# Altium schematic sheet Lab7-8_CH1.SchDoc
size B; DrawnBy: Aaron Huinink; SheetNumber: 2; SheetTotal: 5
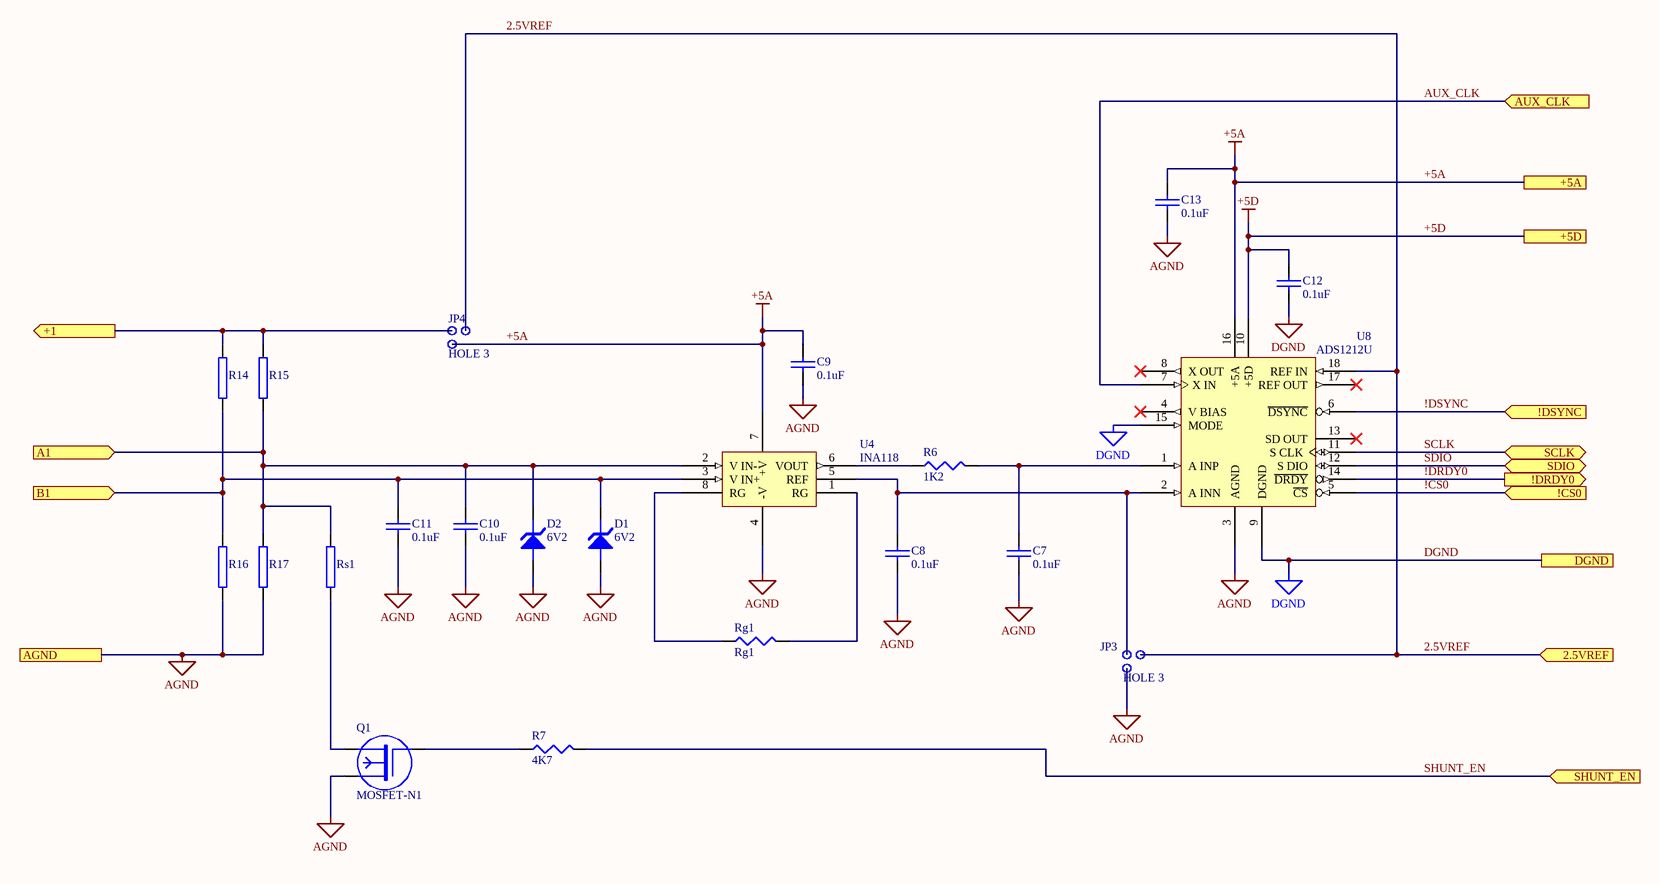
[diagram p0: Lab7-8_CH1.SchDoc]

## Parts
C7  0.1uF  [0805]
C8  0.1uF  [0805]
C9  0.1uF  [0805]
C10  0.1uF  [0805]
C11  0.1uF  [0805]
C12  0.1uF  [0805]
C13  0.1uF  [0805]
D1  6V2  [SOD-123]
D2  6V2  [SOD-123]
JP3  HOLE 3  [RAD0.1A]
JP4  HOLE 3  [RAD0.1A]
Q1  MOSFET-N1  [SOT-23]
R6  1K2  [0805]
R7  4K7  [0805]
R14  bridge R  [bridge resistor]  (value not drawn)
R15  bridge R  [bridge resistor]  (value not drawn)
R16  bridge R  [bridge resistor]  (value not drawn)
R17  bridge R  [bridge resistor]  (value not drawn)
Rg1  Rg1  [0805]
Rs1  bridge R  [bridge resistor]  (value not drawn)
U4  INA118  [SO-8]
U8  ADS1212U  [SOIC18]

## Ports
2.5VREF (in, see Lab7-8_TOP[4C], Lab7-8_CH2[6C], Lab7-8_CH3[6C], Lab7-8_CH4[6C]), !CS0 (in, see Lab7-8_TOP[4C]), !DRDY0 (out, see Lab7-8_TOP[4C]), !DSYNC (in, see Lab7-8_TOP[4C], Lab7-8_CH2[5B], Lab7-8_CH3[6B], Lab7-8_CH4[5B]), +1 (out, see Lab7-8_TOP[3C]), +5A (see Lab7-8_TOP[4C], Lab7-8_CH2[6B], Lab7-8_CH3[6B], Lab7-8_CH4[6B]), +5D (see Lab7-8_TOP[4C], Lab7-8_CH2[6B], Lab7-8_CH3[6B], Lab7-8_CH4[6B]), A1 (in, see Lab7-8_TOP[3C]), AGND (see Lab7-8_TOP[3C], Lab7-8_CH2[1C], Lab7-8_CH3[1C], Lab7-8_CH4[1C]), AUX_CLK (in, see Lab7-8_TOP[4C], Lab7-8_CH2[5A], Lab7-8_CH4[5A]), B1 (in, see Lab7-8_TOP[3C]), DGND (see Lab7-8_TOP[4C], Lab7-8_CH2[6C], Lab7-8_CH3[6C], Lab7-8_CH4[6C]), SCLK (bidir, see Lab7-8_TOP[4C], Lab7-8_CH2[5B], Lab7-8_CH3[6B], Lab7-8_CH4[5B]), SDIO (bidir, see Lab7-8_TOP[4C], Lab7-8_CH2[5B], Lab7-8_CH3[6B], Lab7-8_CH4[5B]), SHUNT_EN (in, see Lab7-8_TOP[4C], Lab7-8_CH2[6C], Lab7-8_CH3[6C], Lab7-8_CH4[6C])

## Nets
+5A: C9.1 C13.1 JP4.1 U4.7(+V) U8.16(+5A) ; port +5A  [also labelled +V]
+5D: C12.1 U8.10(+5D) ; port +5D
-V: C7.2 C8.2 C9.2 C10.2 C11.2 C13.2 D1.A D2.A JP3.1 Q1.2 R16.1 R17.1 U4.4(-V) U8.3(AGND) ; port AGND  [also labelled AGND]
DGND: C12.2 U8.9(DGND) U8.15(MODE) ; port DGND
2.5VREF: JP3.3 JP4.3 U8.18(REF_IN) ; port 2.5VREF
!CS0: U8.5(~{CS}) ; port !CS0
!DRDY0: U8.14(~{DRDY}) ; port !DRDY0
!DSYNC: U8.6(~{DSYNC}) ; port !DSYNC
+1: JP4.2 R14.2 R15.2 ; port +1
A1: C10.1 D2.K R15.1 R17.2 Rs1.2 U4.2(V_IN-) ; port A1
AUX_CLK: U8.7(X_IN) ; port AUX_CLK
B1: C11.1 D1.K R14.1 R16.2 U4.3(V_IN+) ; port B1
SCLK: U8.11(S_CLK) ; port SCLK
SDIO: U8.12(S_DIO) ; port SDIO
SHUNT_EN: R7.2 ; port SHUNT_EN
NetC7_1: C7.1 R6.2 U8.1(A_INP)
NetC8_1: C8.1 JP3.2 U4.5(REF) U8.2(A_INN)
NetQ1_1: Q1.1 R7.1
NetQ1_3: Q1.3 Rs1.1
NetR6_1: R6.1 U4.6(VOUT)
NetRg1_1: Rg1.1 U4.8(RG)
NetRg1_2: Rg1.2 U4.1(RG)

Not connected (* = marked no-connect by the designer): U8 4(V_BIAS)* 8(X_OUT)* 13(SD_OUT)* 17(REF_OUT)*

## Library data of the parts
C7-C13 = CAP
D1 D2 = ZENER3
R6 R7 Rg1 = RES1
R14-R17 Rs1 = RES2
U4 = INA118: Precision, Low Power Instrumentation Amplifier
U8 = ADS1212U(18): 22-Bit Analog-to-Digital Converter